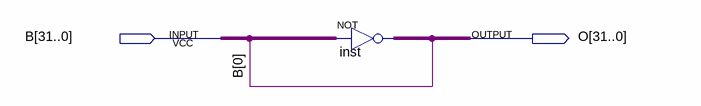
[diagram p0: schematic sheet]
// Quartus schematic inverter.bdf as structural Verilog: 1 symbols, 2 pins
module inverter (
  input  [31:0] B,
  output [31:0] O
);

  assign O = ~B;  // NOT inst, 32 bits wide
endmodule
